# EAGLE design ADS1110 (EAGLE 7.2.0)
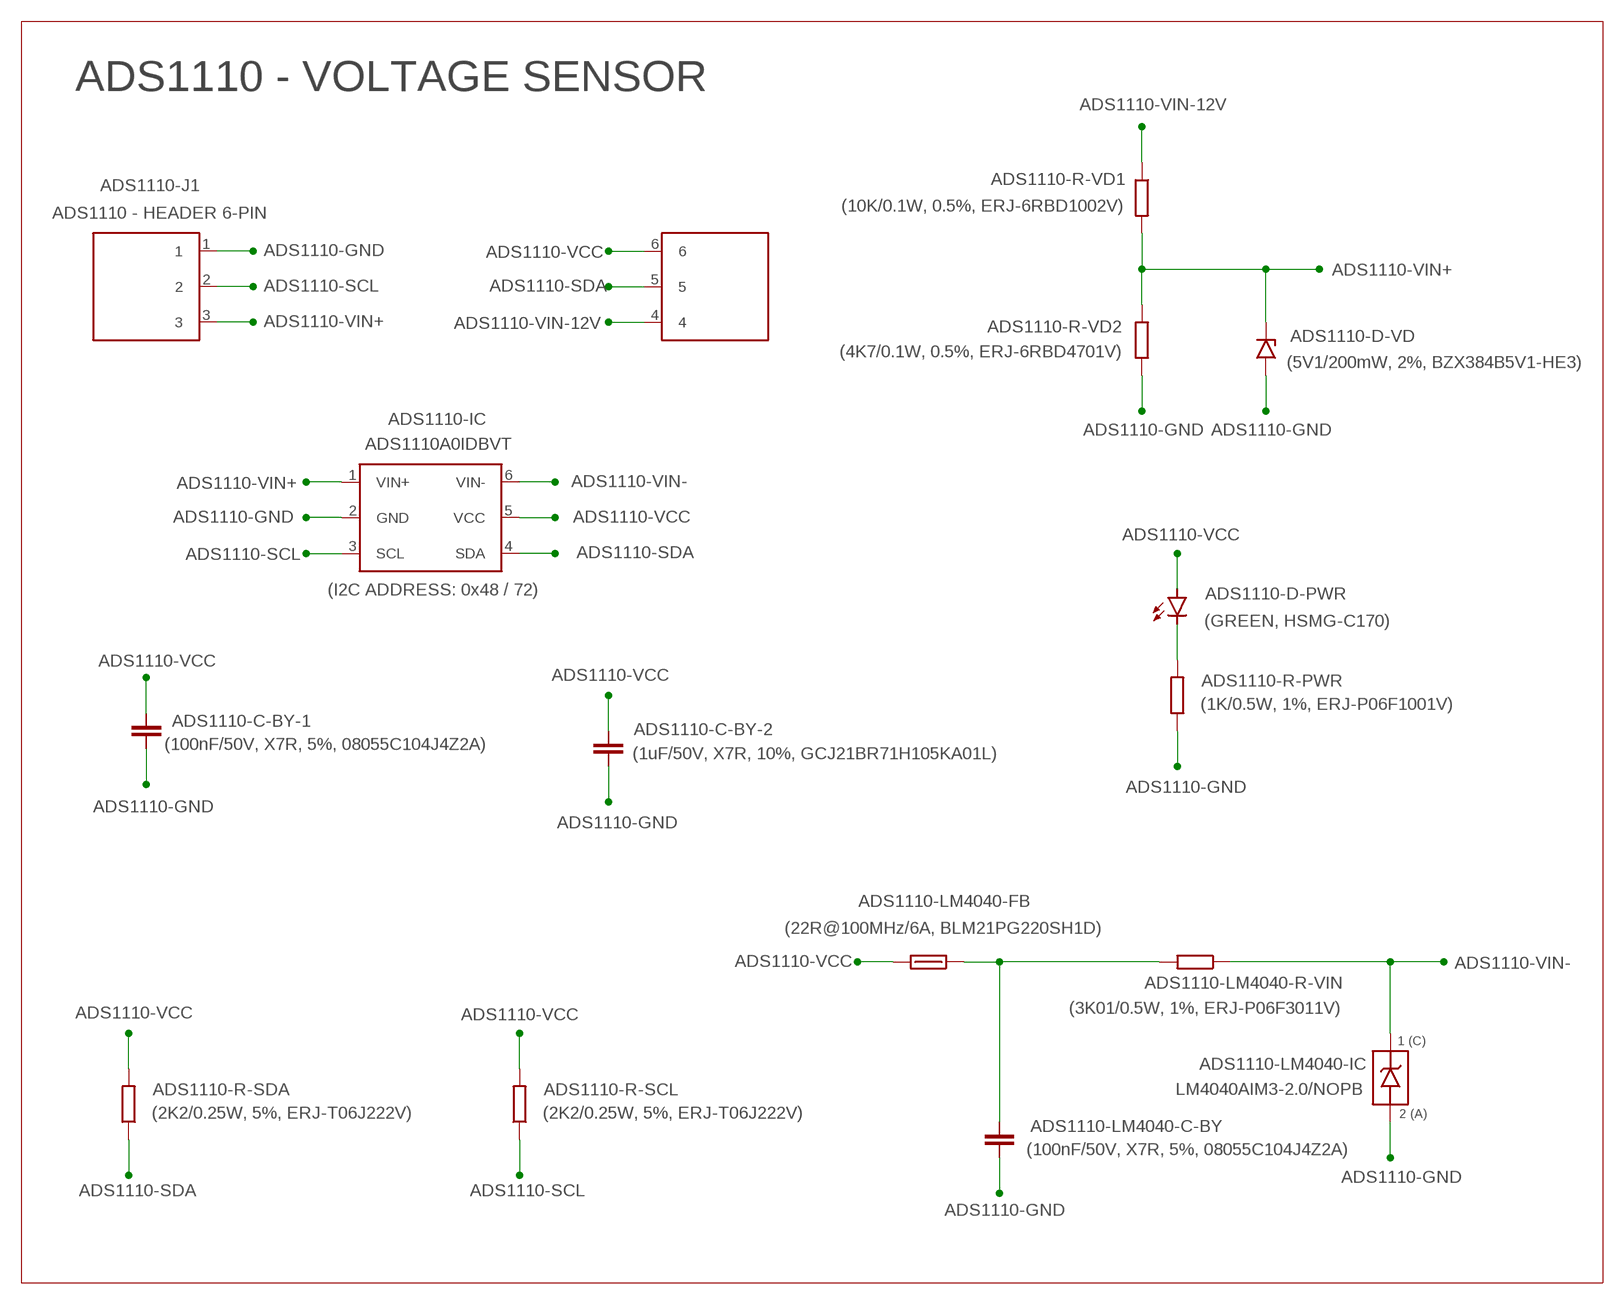
[diagram p0: schematic, sheet 1]

## Parts
ADS1110-C-BY-1  (100nF/50V, X7R, 5%, 08055C104J4Z2A)  08055C104J4Z2A  [0805]
ADS1110-C-BY-2  (1uF/50V, X7R, 10%, GCJ21BR71H105KA01L)  GCJ21BR71H105KA01L  [0805]
ADS1110-D-PWR  (GREEN, HSMG-C170)  HSMG-C170  [DIODE_0805]
ADS1110-D-VD  (5V1/200mW, 2%, BZX384B5V1-HE3)  BZX384B5V1-HE3  [SOD-323-DIODE]
ADS1110-IC  ADS1110A0IDBVT  [SOT-457-6]
ADS1110-J1  ADS1110 - HEADER 6-PIN  HEADER_6_PIN  [HEADER_2.54MM_6_PIN_VER]
ADS1110-LM4040-C-BY  (100nF/50V, X7R, 5%, 08055C104J4Z2A)  08055C104J4Z2A  [0805]
ADS1110-LM4040-FB  (22R@100MHz/6A, BLM21PG220SH1D)  BLM21PG220SH1D  [0805]
ADS1110-LM4040-IC  LM4040AIM3-2.0/NOPB  [SOT-23-3]
ADS1110-LM4040-R-VIN  (3K01/0.5W, 1%, ERJ-P06F3011V)  ERJ-P06F3011V  [0805]
ADS1110-R-PWR  (1K/0.5W, 1%, ERJ-P06F1001V)  ERJ-P06F1001V  [0805]
ADS1110-R-SCL  (2K2/0.25W, 5%, ERJ-T06J222V)  ERJ-T06J222V  [0805]
ADS1110-R-SDA  (2K2/0.25W, 5%, ERJ-T06J222V)  ERJ-T06J222V  [0805]
ADS1110-R-VD1  (10K/0.1W, 0.5%, ERJ-6RBD1002V)  ERJ-6RBD1002V  [0805]
ADS1110-R-VD2  (4K7/0.1W, 0.5%, ERJ-6RBD4701V)  ERJ-6RBD4701V  [0805]

## Nets
ADS1110-GND: ADS1110-C-BY-1.2(C) ADS1110-C-BY-2.1(A) ADS1110-D-VD.A ADS1110-IC.2(GND) ADS1110-J1.1 ADS1110-LM4040-C-BY.2(C) ADS1110-LM4040-IC.2(A) ADS1110-LM4040-IC.3(A) ADS1110-R-PWR.1 ADS1110-R-VD2.2
ADS1110-LED-PWR: ADS1110-D-PWR.C ADS1110-R-PWR.2
ADS1110-SCL: ADS1110-IC.3(SCL) ADS1110-J1.2 ADS1110-R-SCL.1
ADS1110-SDA: ADS1110-IC.4(SDA) ADS1110-J1.5 ADS1110-R-SDA.1
ADS1110-VCC: ADS1110-C-BY-1.1(A) ADS1110-C-BY-2.2(C) ADS1110-D-PWR.A ADS1110-IC.5(VCC) ADS1110-J1.6 ADS1110-LM4040-FB.2 ADS1110-R-SCL.2 ADS1110-R-SDA.2
ADS1110-VCC-FILTERED: ADS1110-LM4040-C-BY.1(A) ADS1110-LM4040-FB.1 ADS1110-LM4040-R-VIN.2
ADS1110-VIN+: ADS1110-D-VD.C ADS1110-IC.1(VIN+) ADS1110-J1.3 ADS1110-R-VD1.2 ADS1110-R-VD2.1
ADS1110-VIN-: ADS1110-IC.6(VIN-) ADS1110-LM4040-IC.1(C) ADS1110-LM4040-R-VIN.1
ADS1110-VIN-12V: ADS1110-J1.4 ADS1110-R-VD1.1

## Notes on the sheet
- ADS1110 - VOLTAGE SENSOR
- (I2C ADDRESS: 0x48 / 72)

## Library data of the parts
ADS1110-C-BY-1 ADS1110-LM4040-C-BY = TDAR4:08055C104J4Z2A: AVX SMD MLCC 0.1uF/50V, X7R, 5%, Flexible, Automotive
ADS1110-C-BY-2 = TDAR4:GCJ21BR71H105KA01L: MURATA SMD MLCC 1uF/50V, X7R, 10%, Flexible, Automotive
ADS1110-D-PWR = TDAR4:HSMG-C170: BROADCOM SMD DIODE LED (GREEN), 15mcd, 20mA, 2.2Vf, 170°, Diffused, Standard
ADS1110-D-VD = TDAR4:BZX384: VISHAY DIODE ZENER 5V1/5V6, 200mW, 2%, AEC-Q101, Automotive http://www.vishay.com/docs/85764/bzx384.pdf 5V1 MOUSER: BZX384B5V1-HE3-08 / BZX384B5V1-HE3-18 (78-BZX384B5V1-HE3-08 / 78-BZX384B5V1-HE3-18) 5V6 MOUSER: BZX384B5V6-HE3-08 / BZX384B5V6-HE3-18 (78-BZX384B5V6-HE3-08 / 78-BZX384B5V6-HE3-18)
ADS1110-IC = TDAR4:ADS1110: TEXAS INSTRUMENTS SMD ADC, 16-BIT, 1-CHANNEL, Onboard Reference (2.048V), I2C, Standard http://www.ti.com/lit/ds/symlink/ads1110.pdf I2C ADDRESSES: Part No. Package I2C Address Marking BIN HEX DEC ADS1110A0IDBVT ED0 01001000 0X48 72 ADS1110A1IDBVT ED1 01001001 0X49 73 ADS1110A2IDBVT ED2 01001010 0X4A 74 ADS1110A3IDBVT ED3 01001011 0X4B 75 ADS1110A4IDBVT ED4 01001100 0X4C 76 ADS1110A5IDBVT ED5 01001101 0X4D 77 ADS1110A6IDBVT ED6 01001110 0X4E 78 ADS1110A7IDBVT ED7 01001111 0X4F 79 MOUSER: 595-ADS1110A0IDBVT (ADS1110A0IDBVT) - 0X48 595-ADS1110A1IDBVT (ADS1110A1IDBVT) - 0X49 595-ADS1110A2IDBVT (ADS1110A2IDBVT) - 0X4A 595-ADS1110A3IDBVT (ADS1110A3IDBVT) - 0X4B 595-ADS1110A4IDBVT (ADS1110A4IDBVT) - 0X4C 595-ADS1110A6IDBVT (ADS1110A6IDBVT) - 0X4E
ADS1110-J1 = TDAR4:HEADER_6_PIN
ADS1110-LM4040-FB = TDAR4:BLM21PG220SH1D: MURATA FERRITE BEAD 22R @ 100MHz, 6A, EMI Filter Powerlines, AEC-Q200, Automotive
ADS1110-LM4040-IC = TDAR4:LM4040: TI SMD IC VOLTAGE REFERENCE SHUNT 2.048V/4.096V, 15mA, 0.1%, AEC-Q100, Automotive LM4040AIM3-2.0/NOPB 2.048V LM4040AIM3-4.1/NOPB 4.096V
ADS1110-LM4040-R-VIN = TDAR4:ERJ-P06F3011V: PANASONIC SMD RESISTOR THICK FILM 3K01/0.5W, 1%, 100ppm, AEC-Q200, Automotive
ADS1110-R-PWR = TDAR4:ERJ-P06F1001V: PANASONIC SMD RESISTOR THICK FILM 1K/0.5W, 1%, 100ppm, AEC-Q200, Automotive
ADS1110-R-SCL ADS1110-R-SDA = TDAR4:ERJ-T06J222V: PANASONIC SMD RESISTOR THICK FILM 2K2/0.25W, 5%, 200ppm, AEC-Q200, Automotive
ADS1110-R-VD1 = TDAR4:ERJ-6RBD1002V: PANASONIC SMD RESISTOR 10K/100mW, 0.5%, 50ppm, AEC-Q200, Automotive
ADS1110-R-VD2 = TDAR4:ERJ-6RBD4701V: PANASONIC SMD RESISTOR 4K7/100mW, 0.5%, 50ppm, AEC-Q200, Automotive

## Net classes
0 default: clearance 0.355 mm

## Board
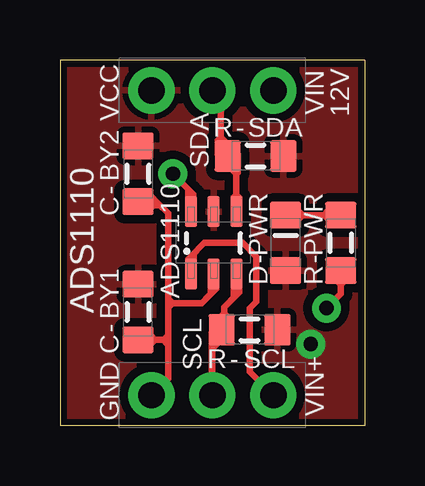
[diagram p1: board, top side]
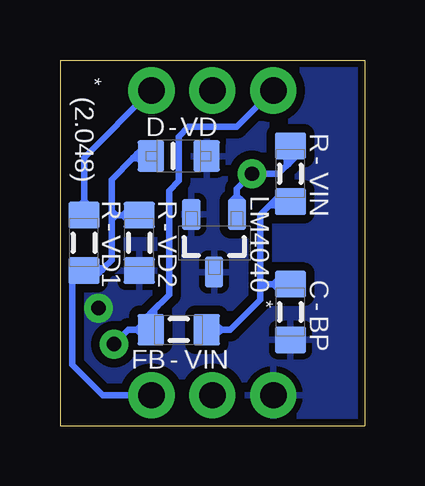
[diagram p2: board, bottom side, seen from below]

Size 12.7 x 15.24 mm. Coordinates in mm from the lower left corner, seen from the top.
Outline: 12.7,15.24 0,15.24 0,0 12.7,0 12.7,15.24
Copper layers (1*16): Top 0.035mm / dielectric 1.5mm / Bottom 0.035mm
Design rules "ITEADstudioDRC *": minimum track width 6mil, minimum drill 12mil, track to track 6mil, track to pad 6mil, pad to pad 6mil, via to via 6mil, smd to smd 0mil, copper to edge 10mil, drill to drill 10mil, minimum pad ring 10mil, minimum via ring 6mil, stop-mask expansion 2mil, vias tented up to drill 100mil, thermal gap 10mil

### Footprints (pad centres in the part's own frame; a part is rotated, then mirrored left to right if it is on the bottom)
0805 = smd 1.1 x 1.3: 1 -1.16,0; 2 1.16,0
DIODE_0805 = smd 1.1 x 1.3: A 1.16,0; C -1.16,0
SOD-323-DIODE = smd 1.1 x 1.3: A 1.16,0; C -1.16,0
SOT-457-6 = smd 1.3 x 0.5: 1 -1.3,0.95; 2 -1.3,0; 3 -1.3,-0.95; 4 1.3,-0.95; 5 1.3,0; 6 1.3,0.95
HEADER_2.54MM_6_PIN_VER = drill 1.1 pad 1.925: 1 -6.35,2.54; 2 -6.35,0; 3 -6.35,-2.54; 4 6.35,-2.54; 5 6.35,0; 6 6.35,2.54
SOT-23-3 = smd 0.75 x 1.3: 1 -0.95,-1.2; 2 0.95,-1.2; 3 0,1.2

### Placement (x,y rotation side)
ADS1110-C-BY-1  3.25,4.74 270 top
ADS1110-C-BY-2  3.25,10.5 90 top
ADS1110-D-PWR  9.4,7.62 270 top
ADS1110-D-VD  7.75,11.24 0 bottom
ADS1110-IC  6.4,7.62 90 top
ADS1110-J1  6.35,7.62 90 top
ADS1110-LM4040-C-BY  3.1,4.74 270 bottom
ADS1110-LM4040-FB  7.75,4 180 bottom
ADS1110-LM4040-IC  6.28,7.6 180 bottom
ADS1110-LM4040-R-VIN  3.1,10.5 270 bottom
ADS1110-R-PWR  11.7,7.62 90 top
ADS1110-R-SCL  7.9,4 0 top
ADS1110-R-SDA  8.15,11.24 0 top
ADS1110-R-VD1  11.7,7.62 270 bottom
ADS1110-R-VD2  9.4,7.62 270 bottom

### Tracks (layer width: path | path; a pad name or v marks a point on that pad's centre or on a via)
ADS1110-GND  (via drill 0.6 pad 1.2)
  Top 0.279: ADS1110-J1.1 4.5,1.96 4.5,3.58 | 4.5,3.64 4.5,5.06 | 4.5,5.1 4.5,8.85 4.01,9.34 3.88,9.34 | 3.88,9.34 ADS1110-C-BY-2.1 | ADS1110-C-BY-1.2 3.95,3.58 | 3.95,3.58 4.5,3.58 | 4.5,5.1 5.9,5.1 6.4,5.6 ADS1110-IC.2 6.4,6.34 6.51,6.34 | v11.1,4.9 11.7,5.5 11.7,5.87 | 3.52,9.66 3.69,9.66 4.17,9.19 | 4.24,9.12 4.17,9.19 | 4.17,9.19 3.92,9.19 | 3.92,9.19 3.72,8.99 3.55,8.99 | 3.88,9.34 3.88,9.46 4.03,9.31 3.88,9.16 3.88,9.19 | 4.47,3.64 4.47,3.43 4.32,3.58 4.47,3.73 4.47,3.64 | 3.95,3.57 3.8,3.42 3.8,3.72 3.95,3.57 | 4.54,5.06 4.54,5.25 4.69,5.1 4.54,4.95 4.54,5.06 | 3.95,3.57 3.95,3.58 | 4.5,3.58 4.5,3.64 | 4.5,3.64 4.47,3.64 | 4.5,5.1 4.5,5.06 | 4.5,5.06 4.54,5.06 | 3.88,9.19 3.88,9.34 | 3.88,9.19 3.92,9.19 | 11.7,5.87 11.55,6.02 11.85,6.02 11.7,5.87 | 11.7,5.87 ADS1110-R-PWR.1 | 6.46,6.39 6.51,6.34 | 6.51,6.34 6.51,5.72 6.29,5.49 | 6.1,5.3 6.29,5.49 | 6.29,5.49 6.29,6.09
  pour Bottom (isolate 0.279): 0.16,0.16 0.16,15.08 12.54,15.08 12.54,0.16
ADS1110-LED-PWR
  Top 0.279: ADS1110-D-PWR.C 9.96,8.78 | 9.96,8.78 ADS1110-R-PWR.2 11.15,8.78 | 11.15,8.78 11.15,8.63 11,8.78 11.15,8.93 11.15,8.78 | 9.96,8.78 9.96,8.92 10.11,8.77 9.96,8.62 9.96,8.78
ADS1110-SCL
  Top 0.279: 6.84,4.69 6.84,4.94 7.35,5.45 ADS1110-IC.3 7.35,6.3 7.4,6.3 7.46,6.24 7.46,5.55 7.24,5.33 | 6.84,4.69 6.84,4 ADS1110-R-SCL.1 6.35,4 ADS1110-J1.2 6.33,1.27 6.33,1.29 | 6.84,4.69 6.99,4.54 6.69,4.54 6.84,4.69 | 6.53,4.08 6.33,3.88 6.33,1.29 | 6.33,1.29 ADS1110-J1.2 6.35,3.21 6.63,3.49 | 7.12,5.21 7.24,5.33 | 7.24,5.33 7.24,6.18
ADS1110-SDA
  Top 0.279: 7.35,11.14 ADS1110-IC.4 7.35,8.84 7.24,8.84 | ADS1110-J1.5 6.7,13.97 6.7,11.24 ADS1110-R-SDA.1 7.35,11.24 7.35,11.14 | 6.59,11.3 6.58,11.31 6.58,11.89 6.7,12.01 7.4,11.31 7.4,11.14 | 7.4,11.14 7.4,10.55 7.35,10.49 7.1,10.75 7.1,10.9 | 7.35,11.14 7.4,11.14 | 7.26,8.82 7.24,8.84 | 7.24,8.84 7.24,9.52 7.34,9.63 7.46,9.51 7.46,9.12
ADS1110-VCC  (via drill 0.6 pad 1.2)
  Bottom 0.279: ADS1110-J1.6 5.33,12.45 7.35,12.45 7.75,12.05 7.75,10.2 8.15,9.8 8.15,5.46 8.91,4.7 ADS1110-LM4040-FB.2 9.25,4 | v10.45,3.4 9.85,4 9.36,4 | 9.25,4 9.25,4.37 8.78,4.84 | 8.66,4.96 8.78,4.84 | 8.78,4.84 8.78,4.55 8.67,4.45 8.58,4.45 8.81,4.67 8.9,4.67 | 9.36,4 9.36,4.16 9.51,4.01 9.36,3.86 9.36,4 | 9.36,4 9.25,4
  pour Top (isolate 0.279): 0.16,0.16 0.16,15.08 12.54,15.08 12.54,0.16
ADS1110-VCC-FILTERED
  Bottom 0.279: 5.99,4 5.6,4 4.35,5.25 4.35,5.9 | 4.35,5.9 4.35,8.8 3.86,9.29 | 3.86,9.29 3.81,9.34 ADS1110-LM4040-R-VIN.2 | ADS1110-LM4040-C-BY.1 3.82,5.9 | 3.82,5.9 4.31,5.9 | 4.31,5.9 4.35,5.9 | 3.42,9.68 3.47,9.68 3.9,9.25 | 4.08,9.06 3.9,9.25 | 3.9,9.25 3.77,9.25 | 3.77,9.25 3.57,9.05 3.38,9.05 3.55,9.22 3.87,9.22 3.87,9.18 | 3.77,9.25 3.77,9.29 3.86,9.29 | 4.31,5.9 4.31,5.74 4.16,5.89 4.31,6.04 4.31,5.9 | 3.82,5.89 3.67,5.75 3.67,6.04 3.82,5.89 | 3.82,5.89 3.82,5.9 | 5.99,4 6.14,4.15 6.14,3.85 5.99,4 | 5.99,4 ADS1110-LM4040-FB.1 | 3.57,8.98 3.57,9.01 3.73,9.18 3.87,9.18 | 3.87,9.18 3.89,9.18
ADS1110-VIN+
  Top 0.279: ADS1110-J1.3 7.9,2.26 7.9,4.9 8.18,5.17 8.18,7.05 7.61,7.62 6.02,7.62 5.45,7.05 ADS1110-IC.1 5.56,6.32 | 5.5,6.13 5.56,6.2 5.56,6.32 | 5.56,6.32 5.56,7.15 5.34,6.93 5.34,6.48
  Bottom 0.279: 10.99,6.46 ADS1110-R-VD1.2 12.2,6.46 12.2,2.55 10.92,1.27 ADS1110-J1.3 | 10.99,6.46 10.89,6.56 | 10.89,6.56 10.55,6.9 10.55,8.78 | 9.56,11.24 ADS1110-D-VD.C | ADS1110-R-VD2.1 10.09,8.78 | 10.09,8.78 10.55,8.78 | 9.56,11.24 9.66,11.14 | 9.66,11.14 10.55,10.25 10.55,8.79 | 9.09,11.58 9.22,11.58 9.56,11.24 | 9.56,11.24 9.6,11.2 | 9.81,10.99 9.6,11.2 | 9.6,11.2 9.44,11.2 9.23,10.99 | 9.56,11.24 | 10.09,8.78 9.94,8.62 9.94,8.93 10.09,8.78 | 10.51,8.79 10.51,8.62 10.36,8.78 10.51,8.93 10.51,8.79 | 10.55,8.78 10.55,8.79 | 10.55,8.79 10.51,8.79 | 10.09,8.78 | 11.51,6.14 11.31,6.14 10.99,6.46 | 10.89,6.56 11.12,6.56 11.33,6.76 | 11.33,6.76 11.43,6.76 | 11.33,6.76 11.26,6.76 11.04,6.54 | 9.37,11.35 9.45,11.35 9.56,11.24 | 9.66,11.14 9.43,11.14 9.43,11.11 9.29,10.97
ADS1110-VIN-  (via drill 0.6 pad 1.2)
  Top 0.279: v4.7,10.5 5.45,9.75 5.45,9.68 | ADS1110-IC.6 5.45,9.68 | 5.51,8.82 5.34,8.98 5.34,9.78 5.38,9.82 | 5.38,9.82 5.56,9.64 5.56,9.05 | 5.38,9.82 5.38,9.68 5.45,9.68
  Bottom 0.279: 5.33,9.48 ADS1110-LM4040-IC.1 5.42,8.8 5.42,8.79 5.56,8.94 5.56,9.36 5.33,9.59 5.09,9.35 5.09,8.95 | 5.33,9.48 5.33,9.87 v4.7,10.5 3.6,10.5 3.24,10.86 | ADS1110-LM4040-R-VIN.1 3.1,11.12 | 3.24,10.86 3.1,11 3.1,11.12 | 2.61,11.44 2.66,11.44 3.16,10.95 | 3.28,10.82 3.16,10.95 | 3.16,10.95 3.16,11.12 | 3.16,11.12 3.33,11.29 | 3.1,11.12 3.16,11.12 | 3.46,11.33 3.24,11.11 3.24,10.86 | 5.33,9.51 5.47,9.36 5.17,9.36 5.33,9.51 | 5.33,9.51 5.33,9.48
ADS1110-VIN-12V
  Bottom 0.279: ADS1110-J1.4 11.7,11.16 ADS1110-R-VD1.1 11.84,8.78 11.84,9.23 | 11.84,9.23 11.54,9.23 11.69,9.38 11.84,9.23

### Text on the board
tNames: VCC | VIN | 12V | SDA | R | - | SDA | BY2 | - | C | ADS1110 | ADS1110 | PWR | PWR | - | - | BY1 | D | R | - | C | SCL | R | - | SCL | + | GND | VIN
bNames: * | R | VD | - | D | (2.048) | - | VIN | R | R | LM4040 | - | - | VD2 | VD1 | C | - | * | BP | VIN | - | FB